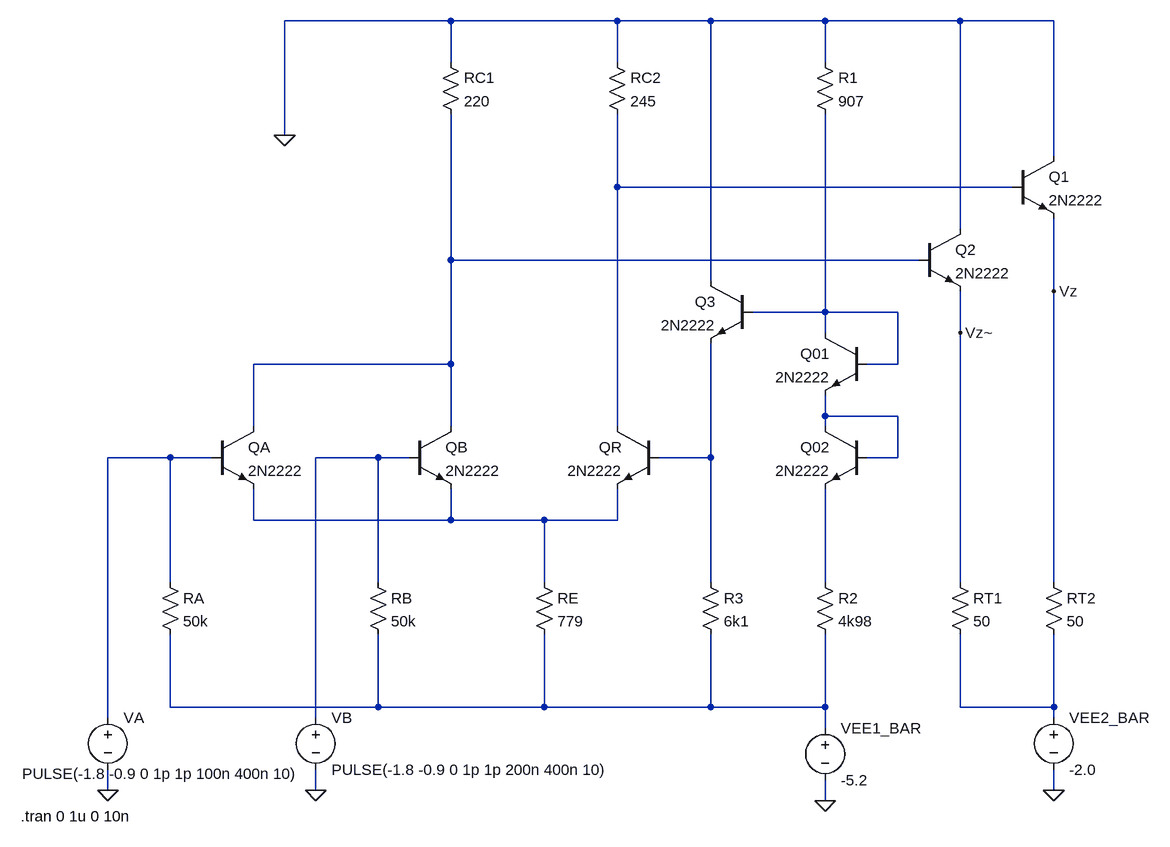
[diagram p0: schematic Task3.asc]
Task3.asc, the LTspice schematic file:
Version 4
SHEET 1 880 816
WIRE -448 -496 -704 -496
WIRE -192 -496 -448 -496
WIRE -48 -496 -192 -496
WIRE 128 -496 -48 -496
WIRE 336 -496 128 -496
WIRE 480 -496 336 -496
WIRE -448 -432 -448 -496
WIRE -192 -432 -192 -496
WIRE 128 -432 128 -496
WIRE -704 -320 -704 -496
WIRE 480 -288 480 -496
WIRE -192 -240 -192 -352
WIRE 416 -240 -192 -240
WIRE 336 -176 336 -496
WIRE -448 -128 -448 -352
WIRE 272 -128 -448 -128
WIRE -48 -96 -48 -496
WIRE 480 -80 480 -192
WIRE 128 -48 128 -352
WIRE 128 -48 16 -48
WIRE 240 -48 128 -48
WIRE 128 -16 128 -48
WIRE 336 -16 336 -80
WIRE -448 32 -448 -128
WIRE -448 32 -752 32
WIRE 240 32 240 -48
WIRE 240 32 192 32
WIRE 128 112 128 80
WIRE 240 112 128 112
WIRE -752 128 -752 32
WIRE -448 128 -448 32
WIRE -192 128 -192 -240
WIRE 128 128 128 112
WIRE -880 176 -976 176
WIRE -816 176 -880 176
WIRE -560 176 -656 176
WIRE -512 176 -560 176
WIRE -48 176 -48 0
WIRE -48 176 -128 176
WIRE 240 176 240 112
WIRE 240 176 192 176
WIRE -752 272 -752 224
WIRE -448 272 -448 224
WIRE -448 272 -752 272
WIRE -304 272 -448 272
WIRE -192 272 -192 224
WIRE -192 272 -304 272
WIRE -880 368 -880 176
WIRE -560 368 -560 176
WIRE -304 368 -304 272
WIRE -48 368 -48 176
WIRE 128 368 128 224
WIRE 336 368 336 -16
WIRE 480 368 480 -80
WIRE -880 560 -880 448
WIRE -560 560 -560 448
WIRE -560 560 -880 560
WIRE -304 560 -304 448
WIRE -304 560 -560 560
WIRE -48 560 -48 448
WIRE -48 560 -304 560
WIRE 128 560 128 448
WIRE 128 560 -48 560
WIRE 336 560 336 448
WIRE 480 560 480 448
WIRE 480 560 336 560
WIRE -976 576 -976 176
WIRE -656 576 -656 176
WIRE 480 576 480 560
WIRE 128 592 128 560
WIRE -976 688 -976 656
WIRE -656 688 -656 656
WIRE 480 688 480 656
WIRE 128 704 128 672
FLAG -704 -320 0
FLAG -976 688 0
FLAG -656 688 0
FLAG 128 704 0
FLAG 480 688 0
FLAG 480 -80 Vz
FLAG 336 -16 Vz~
SYMBOL npn 416 -288 R0
SYMATTR InstName Q1
SYMATTR Value 2N2222
SYMBOL npn 272 -176 R0
SYMATTR InstName Q2
SYMATTR Value 2N2222
SYMBOL npn 192 -16 M0
SYMATTR InstName Q01
SYMATTR Value 2N2222
SYMBOL npn 192 128 M0
SYMATTR InstName Q02
SYMATTR Value 2N2222
SYMBOL npn -128 128 M0
SYMATTR InstName QR
SYMATTR Value 2N2222
SYMBOL npn -512 128 R0
SYMATTR InstName QB
SYMATTR Value 2N2222
SYMBOL npn -816 128 R0
SYMATTR InstName QA
SYMATTR Value 2N2222
SYMBOL npn 16 -96 M0
SYMATTR InstName Q3
SYMATTR Value 2N2222
SYMBOL res 112 -448 R0
SYMATTR InstName R1
SYMATTR Value 907
SYMBOL res -208 -448 R0
SYMATTR InstName RC2
SYMATTR Value 245
SYMBOL res -464 -448 R0
SYMATTR InstName RC1
SYMATTR Value 220
SYMBOL res 464 352 R0
SYMATTR InstName RT2
SYMATTR Value 50
SYMBOL res 320 352 R0
SYMATTR InstName RT1
SYMATTR Value 50
SYMBOL res 112 352 R0
SYMATTR InstName R2
SYMATTR Value 4k98
SYMBOL res -64 352 R0
SYMATTR InstName R3
SYMATTR Value 6k1
SYMBOL res -320 352 R0
SYMATTR InstName RE
SYMATTR Value 779
SYMBOL res -576 352 R0
SYMATTR InstName RB
SYMATTR Value 50k
SYMBOL res -896 352 R0
SYMATTR InstName RA
SYMATTR Value 50k
SYMBOL voltage -976 560 R0
WINDOW 3 -132 102 Left 2
WINDOW 123 0 0 Left 0
WINDOW 39 0 0 Left 0
SYMATTR InstName VA
SYMATTR Value PULSE(-1.8 -0.9 0 1p 1p 100n 400n 10)
SYMBOL voltage -656 560 R0
WINDOW 123 0 0 Left 0
WINDOW 39 0 0 Left 0
SYMATTR InstName VB
SYMATTR Value PULSE(-1.8 -0.9 0 1p 1p 200n 400n 10)
SYMBOL voltage 128 576 R0
SYMATTR InstName VEE1_BAR
SYMATTR Value -5.2
SYMBOL voltage 480 560 R0
SYMATTR InstName VEE2_BAR
SYMATTR Value -2.0
TEXT -1110 728 Left 2 !.tran 0 1u 0 10n

The netlist it stands for:
* Task3.asc
Q1 0 N001 Vz 0 2N2222
Q2 0 N002 Vz~ 0 2N2222
Q01 N003 N003 N004 0 2N2222
Q02 N004 N004 N009 0 2N2222
QR N001 N007 N008 0 2N2222
QB N002 N006 N008 0 2N2222
QA N002 N005 N008 0 2N2222
Q3 0 N003 N007 0 2N2222
R1 0 N003 907
RC2 0 N001 245
RC1 0 N002 220
RT2 Vz N011 50
RT1 Vz~ N011 50
R2 N009 N010 4k98
R3 N007 N010 6k1
RE N008 N010 779
RB N006 N010 50k
RA N005 N010 50k
VA N005 0 PULSE(-1.8 -0.9 0 1p 1p 100n 400n 10)
VB N006 0 PULSE(-1.8 -0.9 0 1p 1p 200n 400n 10)
VEE1_BAR N010 0 -5.2
VEE2_BAR N011 0 -2.0
.model NPN NPN
.model PNP PNP
.lib standard.bjt
.tran 0 1u 0 10n
.backanno
.end